# EAGLE design ReflectiveIR (EAGLE 7.4.0)
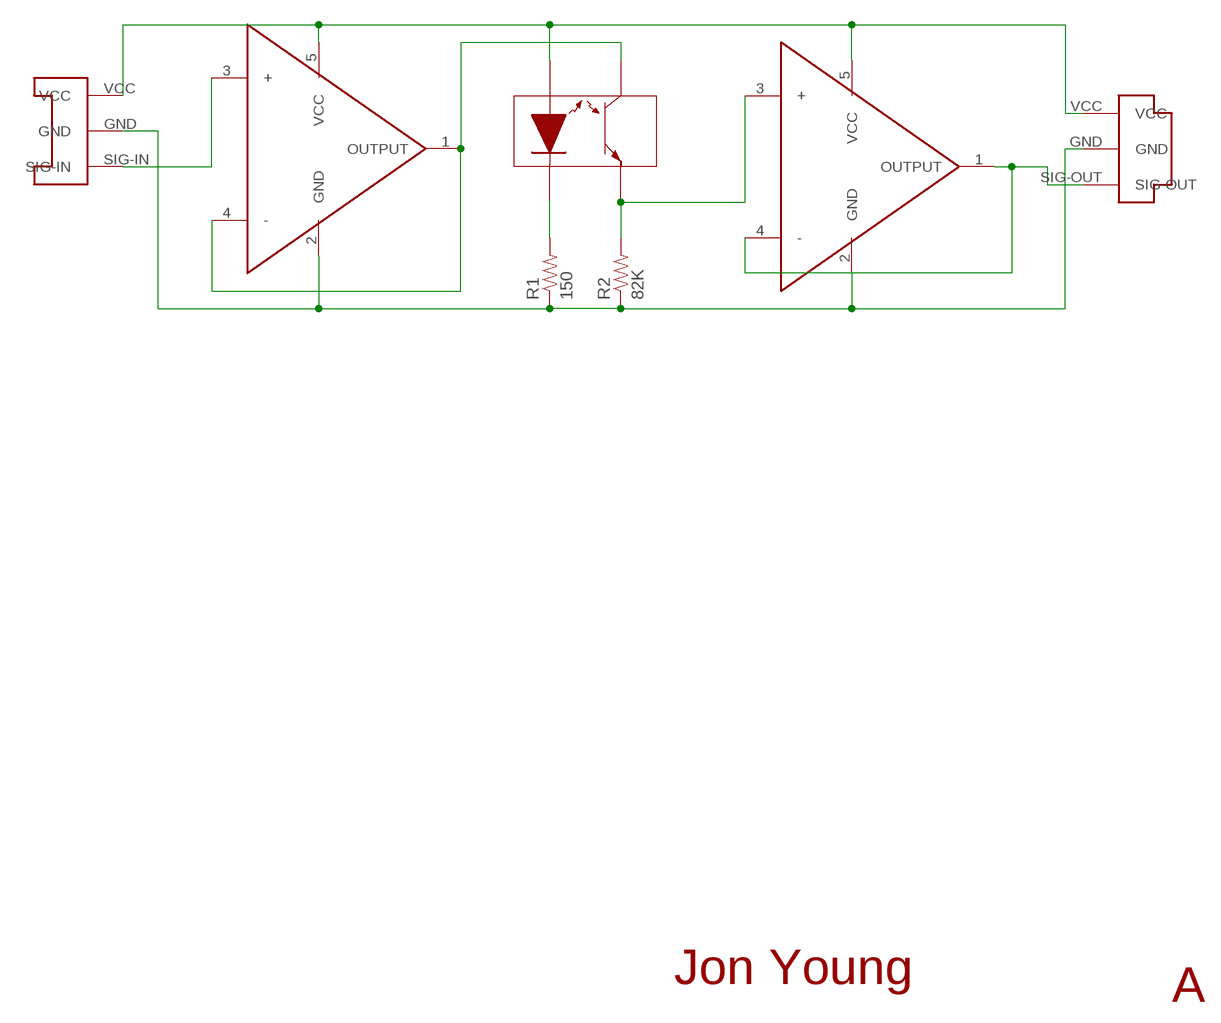
[diagram p0: schematic, sheet 1]

## Parts
R1  150  RESISTOR0603  [0603-RES]
R2  82K  RESISTOR0603  [0603-RES]
U$1  CONN-PLUG-3POS-3MM  [PLUG-3POS-3MM-SMD]
U$2  CONN-SOCKET-3POS-3MM  [SOCKET-3POS-3MM-SMD]
U$3  REFLECTIVE-SENSOR-OPB733TR  [REFLECTIVE-SENSOR-OPB733TR]
U$4  OPAMP-MCP6001SC70-5  [SC70]
U$5  OPAMP-MCP6001SC70-5  [SC70]

## Nets
GND: R1.1 R2.1 U$1.GND U$2.GND U$4.2(GND) U$5.2(GND)
N$5: R2.2 U$3.P2-EMITTER U$5.3(+)
N$6: R1.2 U$3.P1-CATHODE
N$8: U$3.P3-COLLECTOR U$4.1(OUTPUT) U$4.4(-)
N$9: U$2.SIG-IN U$4.3(+)
SIG-OUT: U$1.SIG-OUT U$5.1(OUTPUT) U$5.4(-)
VCC: U$1.VCC U$2.VCC U$3.P4-ANODE U$4.5(VCC) U$5.5(VCC)

## Notes on the sheet
- Jon Young
- A

## Library data of the parts
R1 R2 = SparkFun-Resistors:RESISTOR: Resistor Basic schematic elements and footprints for 0603, 1206, and PTH resistors.
U$1 = EmbeddedPlayground:CONN-PLUG-3POS-3MM: Surface mount board to board connector. Female socket, 3 position.
U$2 = EmbeddedPlayground:CONN-SOCKET-3POS-3MM: Surface mount board to board connector. Female socket, 3 position.
U$3 = EmbeddedPlayground:REFLECTIVE-SENSOR-OPB733TR
U$4 U$5 = EmbeddedPlayground:OPAMP-MCP6001

## Board
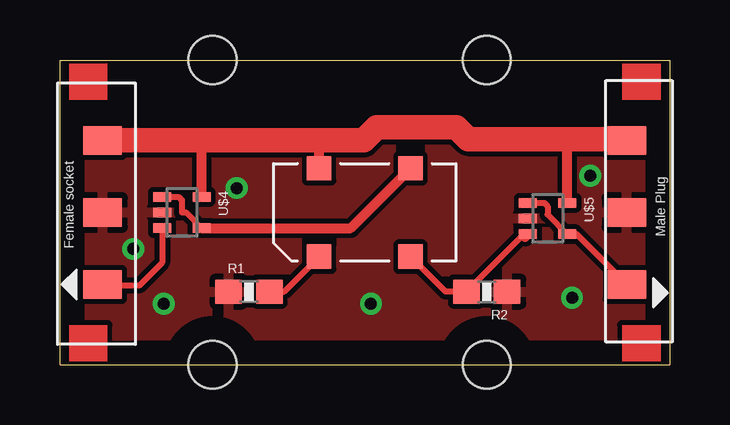
[diagram p1: board, top side]
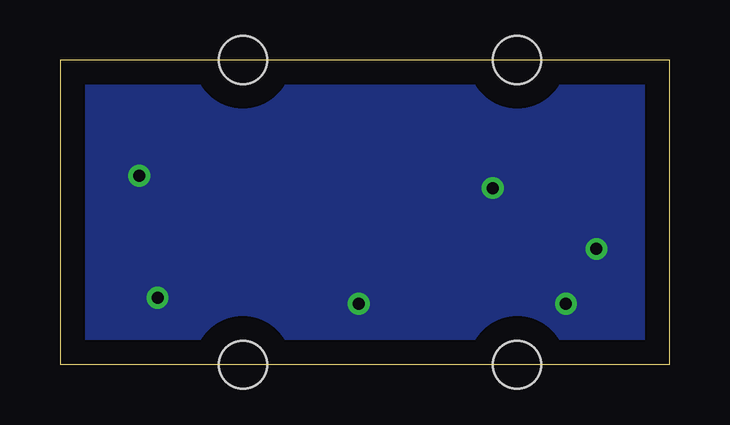
[diagram p2: board, bottom side, seen from below]

Size 25.4 x 12.7 mm. Coordinates in mm from the lower left corner, seen from the top.
Outline: 0,0 25.4,0 25.4,12.7 0,12.7 0,0
Copper layers (1*16): Top 0.035mm / dielectric 1.5mm / Bottom 0.035mm
Design rules "default": minimum track width 10mil, minimum drill 24mil, track to track 8mil, track to pad 8mil, pad to pad 8mil, via to via 8mil, smd to smd 8mil, copper to edge 40mil, drill to drill 8mil, minimum pad ring 10mil, minimum via ring 8mil, stop-mask expansion 4mil, vias tented up to drill 0mil, thermal gap 10mil
Holes 2 mm at 6.35,0 6.35,12.7 17.78,12.7 17.78,0

### Footprints (pad centres in the part's own frame; a part is rotated, then mirrored left to right if it is on the bottom)
0603-RES = smd 1.1 x 1: 1 -0.85,0; 2 0.85,0
PLUG-3POS-3MM-SMD = smd 1.2 x 1.6: GND 0,0; SIG-OUT 3,0; VCC -3,0
SOCKET-3POS-3MM-SMD = smd 1.2 x 1.6: GND 0,0; SIG-IN -3,0; VCC 3,0
REFLECTIVE-SENSOR-OPB733TR = smd 1.016 x 1.016: P1-CATHODE -1.905,-1.841; P2-EMITTER 1.905,-1.841; P3-COLLECTOR 1.905,1.841; P4-ANODE -1.905,1.841
SC70 = smd 0.4 x 0.75: 1 -0.65,-0.825; 2 0,-0.825; 3 0.65,-0.825; 4 0.65,0.825; 5 -0.65,0.825

### Placement (x,y rotation side)
R1  7.87,3.05 0 top
R2  17.78,3.05 180 top
U$1  23.62,6.35 270 top
U$2  1.78,6.35 90 top
U$3  12.7,6.35 0 top
U$4  5.08,6.35 270 top
U$5  20.32,6.1 270 top

### Tracks (layer width: path | path; a pad name or v marks a point on that pad's centre or on a via)
GND  (via drill 0.5)
  other vias: 3.05,4.83 4.32,2.54 21.34,2.79 22.1,7.87 12.95,2.54 7.37,7.37
  pour Top: -1.27,13.91 -1.27,-1.27 29.37,-1.27 29.37,13.91
  pour Bottom: -1.27,13.91 29.62,13.91 29.62,-1.27 -1.27,-1.27
N$5
  Top 0.254: U$3.P2-EMITTER 16.07,3.05 R2.2 19.22,5.33 19.38,5.33
  Top 0.406: 19.38,5.33 U$5.3
N$6
  Top 0.254: R1.2 9.34,3.05 U$3.P1-CATHODE
N$8
  Top 0.254: U$4.1 4.94,7 5.08,6.86 5.08,6.35 5.25,6.35 U$4.4
  Top 0.406: U$4.4 12.11,5.7 U$3.P3-COLLECTOR
N$9
  Top 0.254: U$4.3 4.25,4.25 3.3,3.3 1.83,3.3 U$2.SIG-IN
SIG-OUT
  Top 0.254: U$5.1 20.18,6.75 20.32,6.6 20.32,6.27 U$5.4 21.53,5.45 U$1.SIG-OUT
VCC
  Top 0.406: U$4.5 5.91,9.29 5.84,9.35 | U$3.P4-ANODE 10.79,9.22 10.67,9.35 | U$5.5 21.14,9.21 21.34,9.4
  Top 1.016: U$2.VCC 5.84,9.35 10.67,9.35 12.65,9.35 13.21,9.91 16.51,9.91 17.02,9.4 21.34,9.4 23.57,9.4 U$1.VCC